# Altium project Atmega8_Clock.PrjPCB
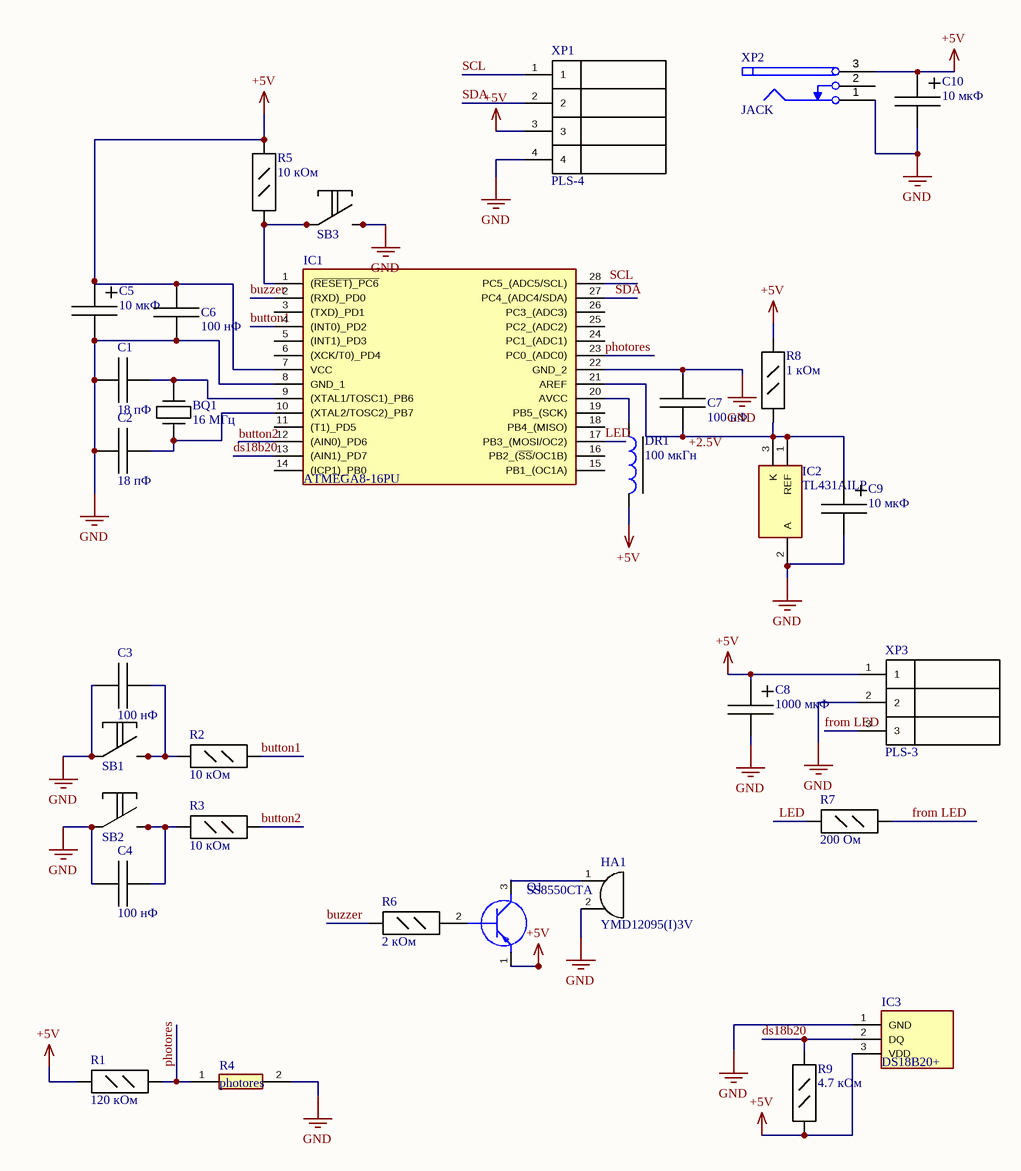
[diagram p0: Atmega8_Clock.SchDoc]
1 sheet, 32 parts. Net scope: global (net labels, ports and power ports of the same name join across sheets).
Board file: Atmega8_Clock.PcbDoc

## Sheet Atmega8_Clock.SchDoc
size 209 x 297 mm; PageSetup: Record=PageOptions|CenterHorizontal=True|CenterVertical=True|PrintScale=0.94|XCorrection=1.00|YCorrection=1.00|PrintKind=1|BorderSize=5000000|LeftOffset=0|BottomOffset=0|Orientation=1|PaperLength=1000|PaperWidth=1000|Scale=100|PaperSource=7|PrintQuality=-4|MediaType=1|DitherType=10|PaperKind=A4|PrintScaleMode=1; DecimalNumber: Децимальный номер; HeadOfSector: Нач. сектора; MainDevice: Перв.примен.; Name: Наименование

### Parts
BQ1  16 МГц  [quarz-KX-3HT]
C1  18 пФ  [CAPC2012L-С0805]
C2  18 пФ  [CAPC2012L-С0805]
C3  100 нФ  [CAP-Y2]
C4  100 нФ  [CAP-Y2]
C5  10 мкФ  [Cap-EL(10x17-5)T]
C6  100 нФ  [CAP-Y2]
C7  100 нФ  [CAP-Y2]
C8  1000 мкФ  [Cap-EL(10x17-5)T]
C9  10 мкФ  [Cap-EL(10x17-5)T]
C10  10 мкФ  [Cap-EL(10x17-5)T]
DR1  100 мкГн  [Inductor-1]
HA1  YMD12095(I)3V  [YMD12095(I)3V]
IC1  ATMEGA8-16PU  [DIP794W53P254L3467H457Q28N]
IC2  TL431AILP  [LP0003A]
IC3  DS18B20+  [DS18B20]
Q1  SS8550CTA  [TO-92-3]
R1  120 кОм  [RESC2012N]
R2  10 кОм  [RESC2012N]
R3  10 кОм  [RESC2012N]
R4  photores  [350-00009]
R5  10 кОм  [RESC2012N]
R6  2 кОм  [RESC2012N]
R7  200 Ом  [RESC2012N]
R8  1 кОм  [RESC2012N]
R9  4.7 кОм  [RESC2012N]
SB1  PushButton6x6  [PushButton6x6]  (value not drawn)
SB2  PushButton6x6  [PushButton6x6]  (value not drawn)
SB3  PushButton6x6  [PushButton6x6]  (value not drawn)
XP1  PLS-4  [PLS-04]
XP2  JACK  [JACK1]
XP3  PLS-3  [PLS-03]

### Nets
+5V: C5.1 C6.2 C8.1 C10.1 DR1.2 IC1.7(VCC) IC3.3(VDD) Q1.1(E) R1.1 R5.2 R8.2 R9.2 XP1.3 XP2.3 XP3.1
GND: C1.1 C2.1 C3.2 C4.2 C5.2 C6.1 C7.2 C8.2 C9.2 C10.2 HA1.2 IC1.8(GND_1) IC1.22(GND_2) IC2.2(A) IC3.1(GND) R4.2 SB1.1 SB1.3 SB2.1 SB2.3 SB3.2 SB3.4 XP1.4 XP2.1 XP3.2
button1: IC1.4((INT0)_PD2) R2.1
button2: IC1.12((AIN0)_PD6) R3.1
buzzer: IC1.2((RXD)_PD0) R6.2
ds18b20: IC1.13((AIN1)_PD7) IC3.2(DQ) R9.1
from LED: R7.1 XP3.3
LED: IC1.17(PB3_(MOSI/OC2)) R7.2
photores: IC1.23(PC0_(ADC0)) R1.2 R4.1
SCL: IC1.28(PC5_(ADC5/SCL)) XP1.1
SDA: IC1.27(PC4_(ADC4/SDA)) XP1.2
NetBQ1_1: BQ1.1 C2.2 IC1.10((XTAL2/TOSC2)_PB7)
NetBQ1_2: BQ1.2 C1.2 IC1.9((XTAL1/TOSC1)_PB6)
NetC3_1: C3.1 R2.2 SB1.2 SB1.4
NetC4_1: C4.1 R3.2 SB2.2 SB2.4
NetC7_1: C7.1 C9.1 IC1.21(AREF) IC2.1(REF) IC2.3(K) R8.1
NetDR1_1: DR1.1 IC1.20(AVCC)
NetHA1_1: HA1.1 Q1.3(C)
NetIC1_1: IC1.1((~{RESET)_PC6}) R5.1 SB3.1 SB3.3
NetQ1_2: Q1.2(B) R6.1

Not connected (* = marked no-connect by the designer): IC1 3((TXD)_PD1) 5((INT1)_PD3) 6((XCK/T0)_PD4) 11((T1)_PD5) 14((ICP1)_PB0) 15(PB1_(OC1A)) 16(PB2_(~{SS}/OC1B)) 18(PB4_(MISO)) 19(PB5_(SCK)) 24(PC1_(ADC1)) 25(PC2_(ADC2)) 26(PC3_(ADC3)); XP2 2

### Notes on the sheet
- Labels drawn without touching a wire or pin: +2.5V
- Перв.примен.
- Справ.№
- Подп. и дата
- Инв.№ дубл.
- Взам.инв.№
- Подп.и дата
- Разраб.
- Изм.
- Лист
- № докум.
- Подп.
- Дата
- Лит.
- Масштаб
- Масса
- Т.контр.
- Пров.
- СХЕМА   ЭЛЕКТРИЧЕСКАЯ
- ПРИНЦИПИАЛЬНАЯ
- Листов
- Инв.№ подл.
- Утв.
- Н.контр.
- Нач.сект.
- Копировал
- Формат  A3

### Library data of the parts
BQ1 = quarz-KX-3HT: Value: 14,7456 МГц
C1 C2 = C0805: планарный конденсатор; Value: 18 пФ
C3 C4 C6 C7 = CAP-Y2: конденсатор; Value: 100 нФ
C5 C8-C10 = Cap-EL(10x17-5)T: конденсатор
  C5 C9 C10: Value: 10 мкФ
  C8: Value: 1000 мкФ
DR1 = inductor: value: 100 мкГн
IC1 = ATMEGA8-16PU: Integrated Circuit; Manufacturer_Name: Microchip; Datasheet Link: http://www.atmel.com/images/atmel-2486-8-bit-avr-microcontroller-atmega8_l_summary.pdf; Height: 4.572mm; Manufacturer_Part_Number: ATMEGA8-16PU; Mouser Part Number: 556-ATMEGA8-16PU; Mouser Price/Stock: https://www.mouser.co.uk/ProductDetail/Microchip-Technology-Atmel/ATMEGA8-16PU?qs=7JStj%2FjQ2SFlSdRaC1qNjQ%3D%3D; Arrow Part Number: ATMEGA8-16PU; Arrow Price/Stock: https://www.arrow.com/en/products/atmega8-16pu/microchip-technology?region=nac
IC2 = TL431AILP: Integrated Circuit; Manufacturer_Name: Texas Instruments; Datasheet Link: https://datasheet.datasheetarchive.com/originals/distributors/Datasheets-SFU2/DSASFU100034171.pdf; Manufacturer_Part_Number: TL431AILP; Mouser Part Number: 595-TL431AILP; Mouser Price/Stock: https://www.mouser.co.uk/ProductDetail/Texas-Instruments/TL431AILP?qs=DcvZ7Fltd5zv1pNIYzWUXQ%3D%3D; Arrow Part Number: TL431AILP; Arrow Price/Stock: https://www.arrow.com/en/products/tl431ailp/texas-instruments
IC3 = DS18B20+: Integrated Circuit; Manufacturer_Name: Maxim Integrated; Datasheet Link: https://ms.componentsearchengine.com/Datasheets/2/DS18B20+.pdf; Height: 4.95mm; Manufacturer_Part_Number: DS18B20+; Mouser Part Number: 700-DS18B20+; Mouser Price/Stock: https://www.mouser.co.uk/ProductDetail/Maxim-Integrated/DS18B20%2b?qs=7H2Jq%252ByxpJKegCKabDbglA%3D%3D
Q1 = SS8550CTA: Transistor BJT PNP; Manufacturer_Name: ON Semiconductor; Datasheet Link: https://www.onsemi.com/pub/Collateral/SS8550-D.pdf; Manufacturer_Part_Number: SS8550CTA; Mouser Part Number: 512-SS8550CTA; Mouser Price/Stock: https://www.mouser.co.uk/ProductDetail/ON-Semiconductor-Fairchild/SS8550CTA?qs=UMEuL5FsraCgmcObR%2FdvUQ%3D%3D; Arrow Part Number: SS8550CTA; Arrow Price/Stock: https://www.arrow.com/en/products/ss8550cta/on-semiconductor?region=nac
R1-R3 R5-R9 = R0805: планарный резистор
  R1: Value: 120 кОм
  R2 R3 R5: Value: 10 кОм
  R6: Value: 2 кОм
  R7: Value: 200 Ом
  R8: Value: 1 кОм
  R9: Value: 4.7 кОм
R4 = 350-00009: Resistor; Manufacturer_Name: Parallax; Datasheet Link: https://datasheet.datasheetarchive.com/originals/distributors/Datasheets-DGA19/1465.pdf; Manufacturer_Part_Number: 350-00009; Mouser Part Number: 619-350-00009; Mouser Price/Stock: https://www.mouser.com/Search/Refine.aspx?Keyword=619-350-00009